# EAGLE design PLP-200+ (EAGLE 8.0.0)
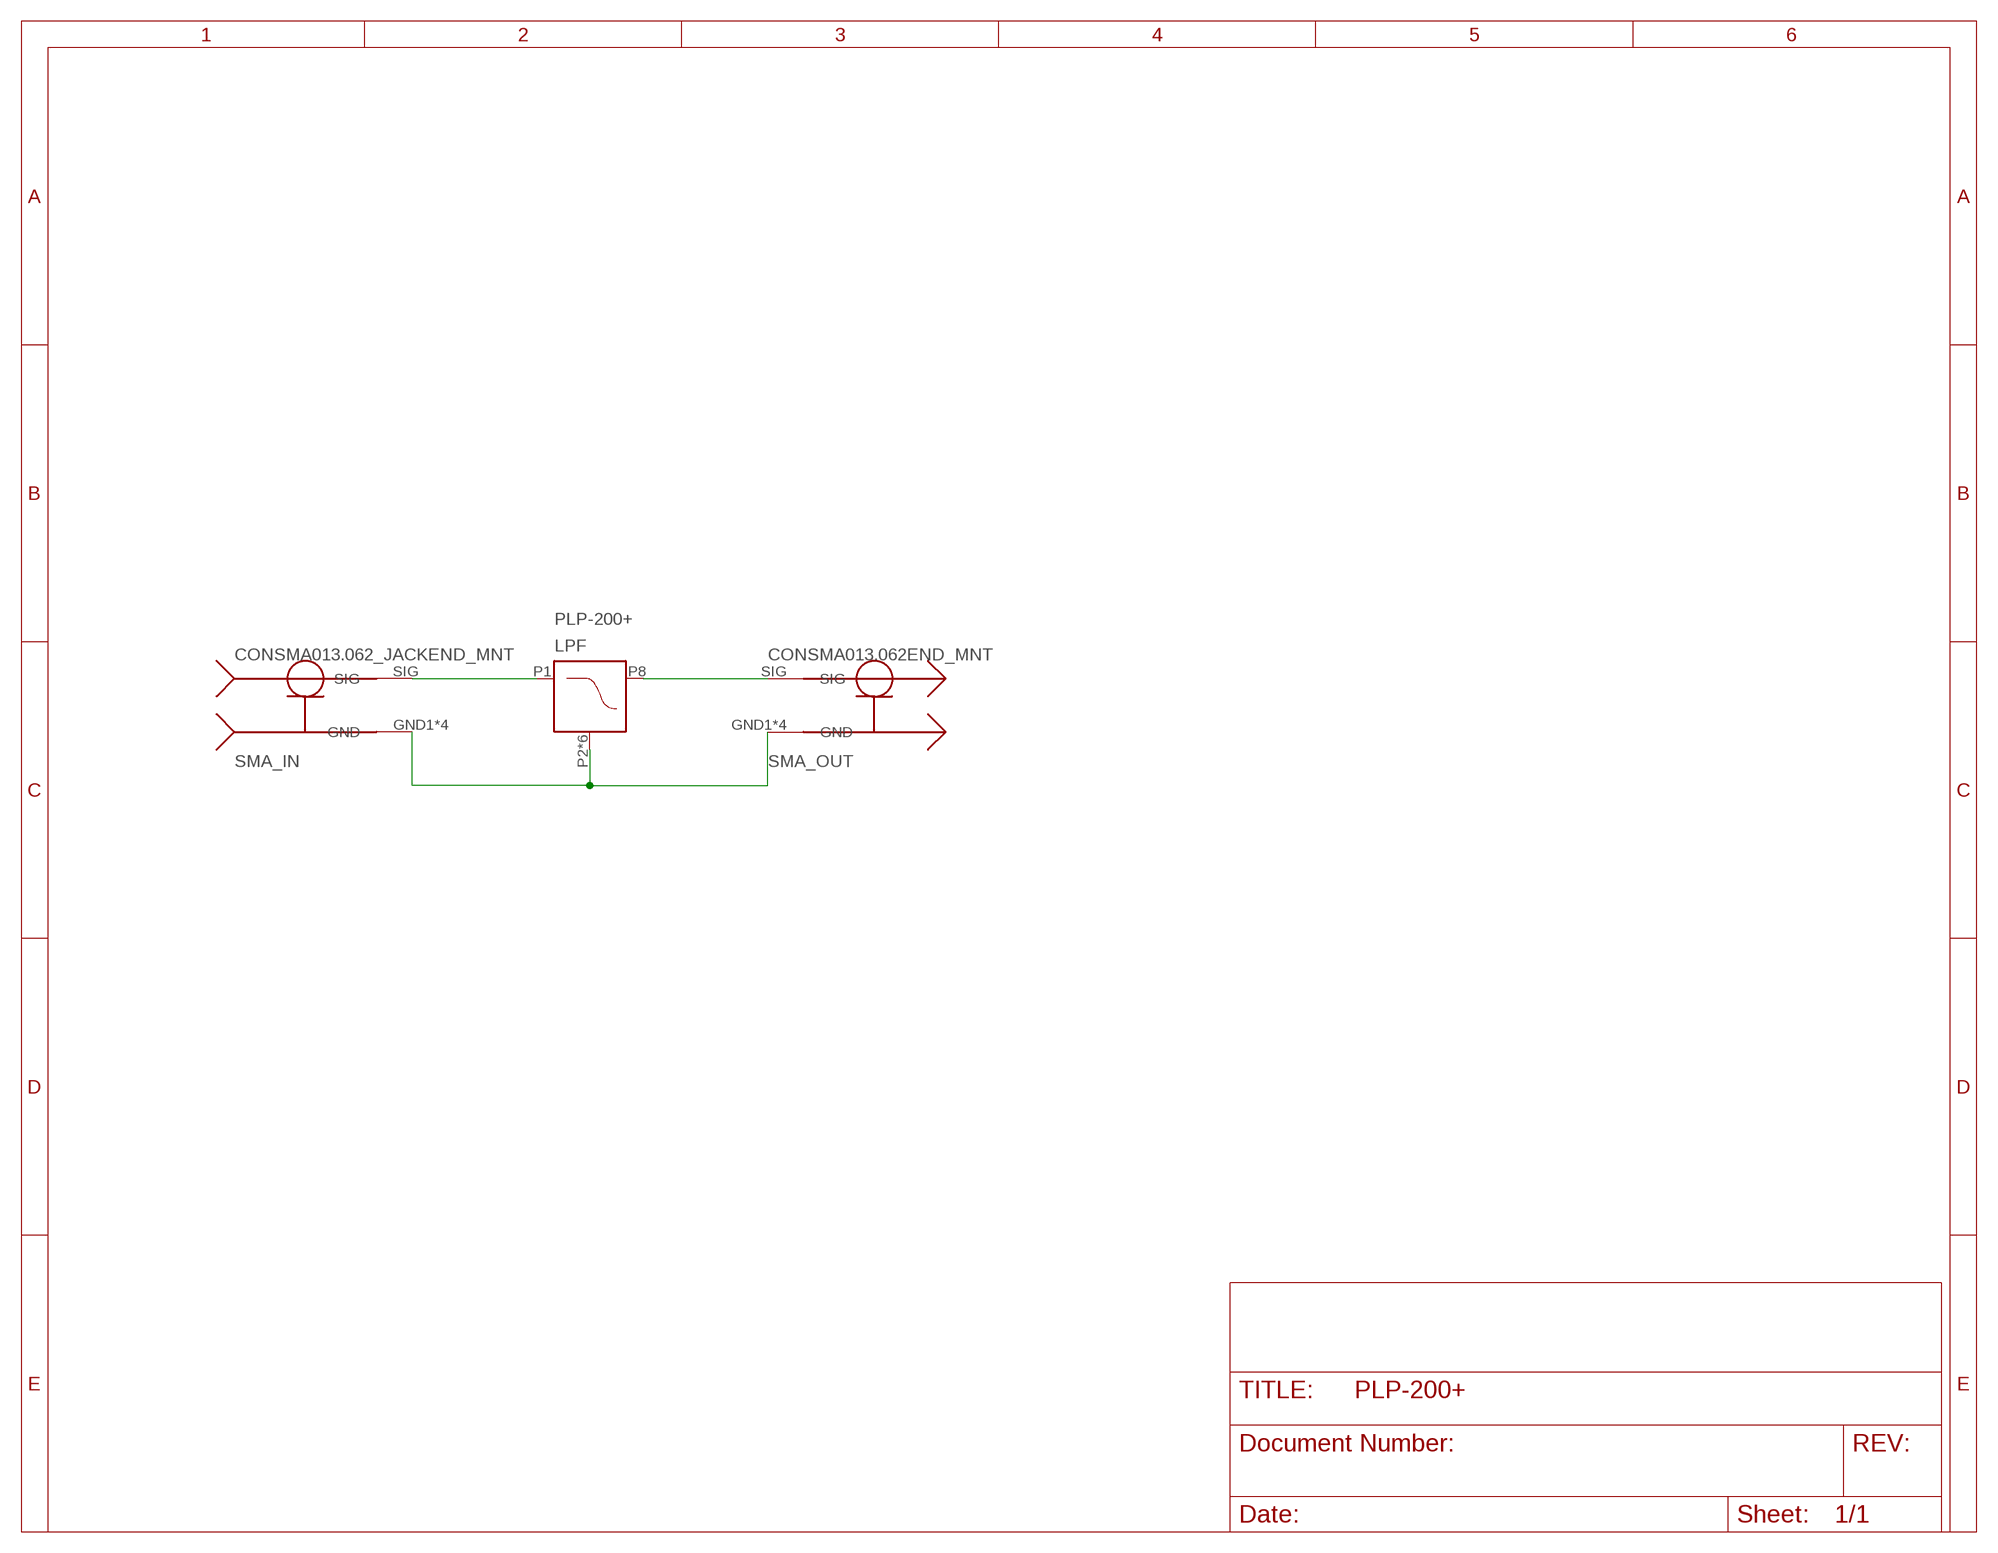
[diagram p0: schematic, sheet 1]

## Parts
LPF  PLP-200+  [A01]
SMA_IN  CONSMA013.062_JACKEND_MNT  [SMA_EDGE_MNT]
SMA_OUT  CONSMA013.062END_MNT  [SMA_EDGE_MNT]

## Nets
GND: LPF.P2(GND) LPF.P3(GND) LPF.P4(GND) LPF.P5(GND) LPF.P6(GND) LPF.P7(GND) SMA_IN.GND1(GND) SMA_IN.GND2(GND) SMA_IN.GND3(GND) SMA_IN.GND4(GND) SMA_OUT.GND1(GND) SMA_OUT.GND2(GND) SMA_OUT.GND3(GND) SMA_OUT.GND4(GND)
N$1: LPF.P1(RF_IN) SMA_IN.SIG
N$2: LPF.P8(RF_OUT) SMA_OUT.SIG

## Library data of the parts
LPF = PLP-200+:PLP-200+
SMA_IN = balun:CONSMA013.062_JACK
SMA_OUT = balun:CONSMA013.062

## Board
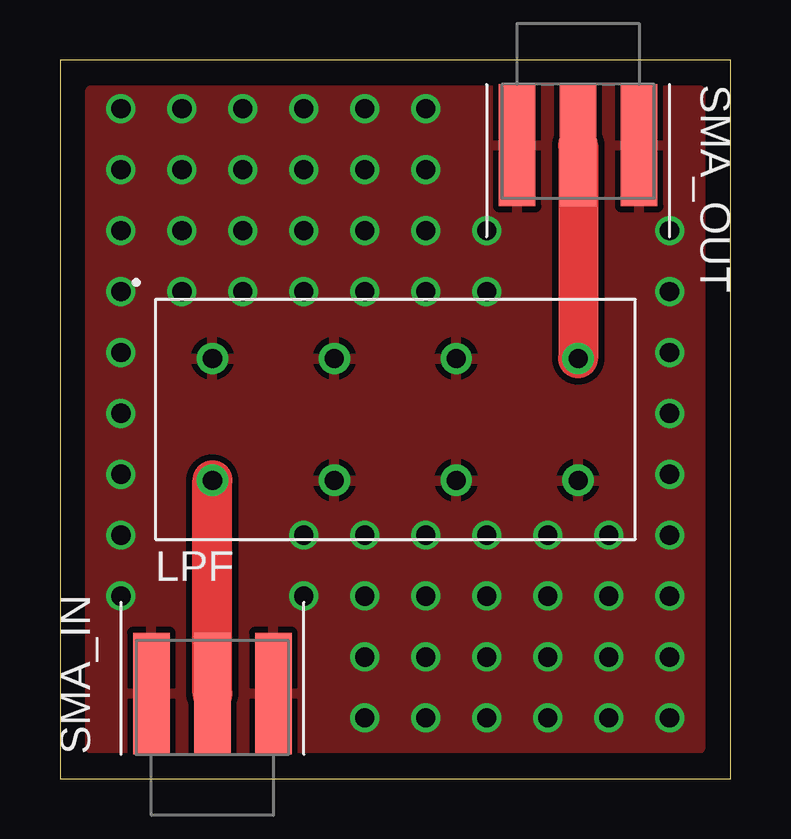
[diagram p1: board, top side]
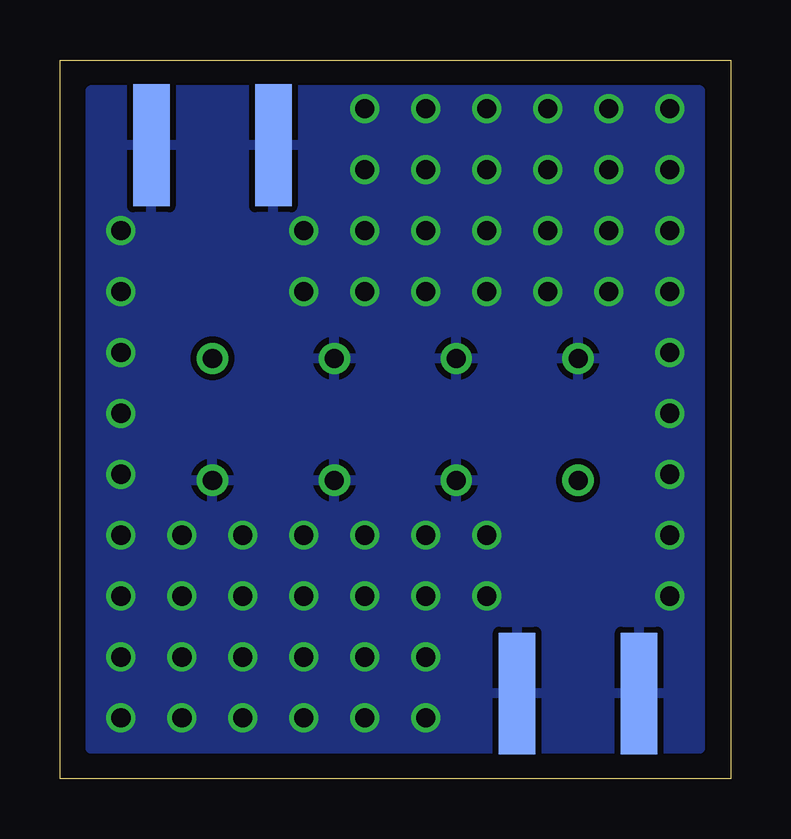
[diagram p2: board, bottom side, seen from below]

Size 27.94 x 29.97 mm. Coordinates in mm from the lower left corner, seen from the top.
Outline: 0,0 27.94,0 27.94,29.97 0,29.97 0,0
Copper layers (1*16): Top 0.035mm / dielectric 1.5mm / Bottom 0.035mm
Design rules "default": minimum track width 10mil, minimum drill 24mil, track to track 8mil, track to pad 8mil, pad to pad 8mil, via to via 8mil, smd to smd 8mil, copper to edge 40mil, drill to drill 8mil, minimum pad ring 10mil, minimum via ring 8mil, stop-mask expansion 4mil, vias tented up to drill 0mil, thermal gap 10mil

### Footprints (pad centres in the part's own frame; a part is rotated, then mirrored left to right if it is on the bottom)
A01 = drill 0.8: P1 -7.62,-2.54; P2 -7.62,2.54; P3 -2.54,-2.54; P4 -2.54,2.54; P5 2.54,-2.54; P6 2.54,2.54; P7 7.62,-2.54; P8 7.62,2.54
SMA_EDGE_MNT = smd 1.524 x 5.08 bottom: GND1 -2.54,0; GND2 2.54,0 | smd 1.524 x 5.08: GND3 -2.54,0; GND4 2.54,0; SIG 0,0

### Placement (x,y rotation side)
LPF  13.97,14.99 0 top
SMA_IN  6.35,3.56 180 top
SMA_OUT  21.59,26.42 0 top

### Tracks (layer width: path | path; a pad name or v marks a point on that pad's centre or on a via)
GND  (via drill 0.8)
  other vias: 2.54,22.86 2.54,20.32 2.54,17.78 2.54,15.24 2.54,25.4 5.08,27.94 7.62,27.94 10.16,25.4 12.7,2.54 15.24,2.54 2.54,27.94 5.08,25.4 7.62,25.4 10.16,27.94 12.7,5.08 15.24,5.08 2.54,7.62 5.08,22.86 7.62,22.86 10.16,7.62 12.7,7.62 15.24,7.62 17.78,7.62 2.54,10.16 2.54,12.7 5.08,20.32 7.62,20.32 10.16,10.16 12.7,10.16 15.24,10.16 17.78,10.16 25.4,7.62 25.4,10.16 25.4,12.7 25.4,15.24 25.4,17.78 25.4,20.32 22.86,2.54 20.32,2.54 17.78,20.32 15.24,20.32 12.7,20.32 10.16,20.32 10.16,22.86 12.7,22.86 12.7,25.4 12.7,27.94 15.24,27.94 15.24,25.4 15.24,22.86 17.78,22.86 17.78,5.08 17.78,2.54 20.32,7.62 20.32,10.16 20.32,5.08 22.86,5.08 22.86,7.62 22.86,10.16 25.4,5.08 25.4,2.54 25.4,22.86
  pour Top (isolate 0.254): 1.27,28.7 26.67,28.7 26.67,1.27 1.27,1.27
  pour Bottom (isolate 0.254): 1.27,28.7 26.67,28.7 26.67,1.27 1.27,1.27
N$1
  Top 1.676: SMA_IN.SIG LPF.P1
N$2
  Top 1.676: SMA_OUT.SIG LPF.P8